# EAGLE schematic schema (EAGLE 7.6.0)
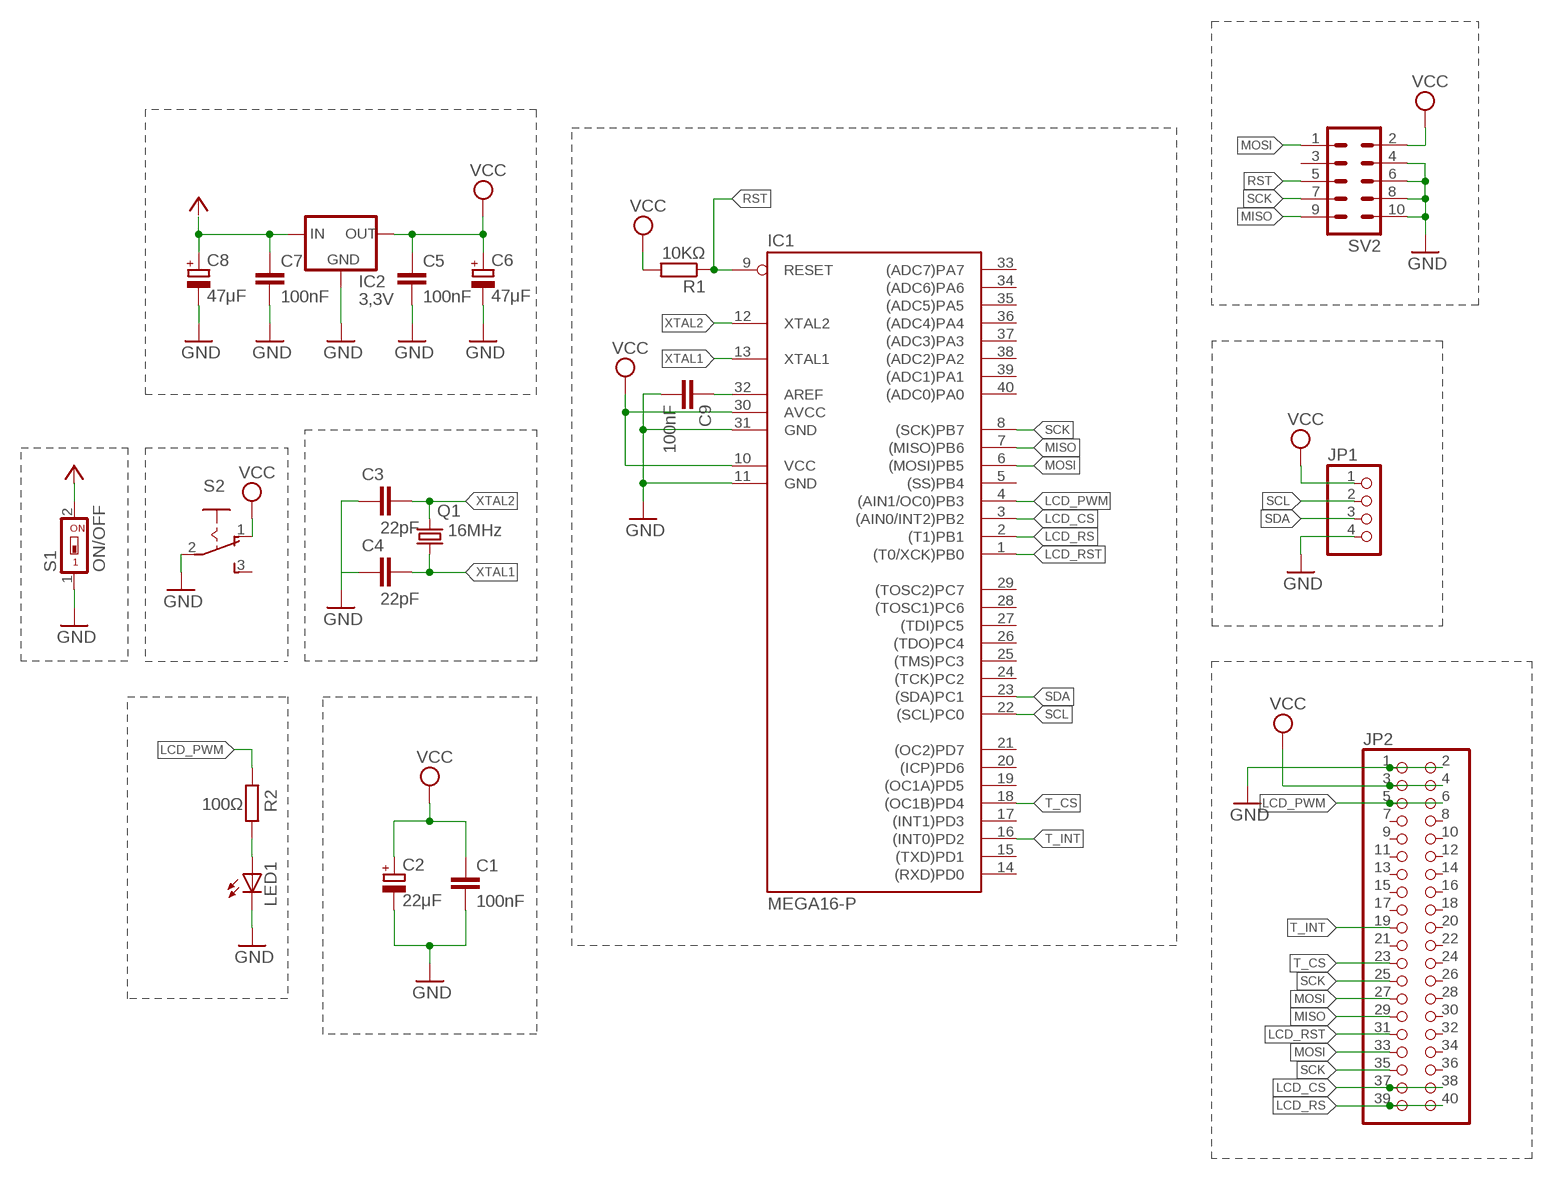
[diagram p0: schematic, sheet 1]

## Parts
C1  100nF  C-EU025-024X044  [C025-024X044]
C2  22μF  CPOL-EU085CS-1AR  [085CS_1AR]
C3  22pF  C-EU025-024X044  [C025-024X044]
C4  22pF  C-EU025-024X044  [C025-024X044]
C5  100nF  C-EU025-024X044  [C025-024X044]
C6  47μF  CPOL-EU085CS-1AR  [085CS_1AR]
C7  100nF  C-EU025-024X044  [C025-024X044]
C8  47μF  CPOL-EU085CS-1AR  [085CS_1AR]
C9  100nF  C-EU025-024X044  [C025-024X044]
IC1  MEGA16-P  [DIL40]
IC2  3,3V  78LXX  [78LXX]
JP1  PINHD-1X4  [1X04]
JP2  PINHD-2X20  [2X20]
LED1  LED  [SMARTLED-TTW]
Q1  16MHz  CRYSTAL68SMX  [86SMX]
R1  10KΩ  R-EU_0204/5  [0204/5]
R2  100Ω  R-EU_0204/5  [0204/5]
S1  ON/OFF  SWS001  [SMS-001]
S2  255SB  [255SB]
SV2  ML10  [ML10]

## Nets
GND: C1.2 C2.- C3.1 C5.2 C6.- C7.2 C8.- C9.2 IC1.11(GND) IC1.31(GND) IC2.GND JP1.4 JP2.1 JP2.2 LED1.C@1(C) S1.1 S2.2(P) SV2.4 SV2.6 SV2.8 SV2.10
LCD_CS: IC1.3((AIN0/INT2)PB2) JP2.37 JP2.38
LCD_PWM: IC1.4((AIN1/OC0)PB3) JP2.5 JP2.6 R2.2
LCD_RS: IC1.2((T1)PB1) JP2.39 JP2.40
LCD_RST: IC1.1((T0/XCK)PB0) JP2.31
MISO: IC1.7((MISO)PB6) JP2.29 SV2.9
MOSI: IC1.6((MOSI)PB5) JP2.27 JP2.33 SV2.1
N$1: LED1.A@1(A) R2.1
N$2: C9.1 IC1.32(AREF)
N$3: S1.2
N$4: C4.1
RST: IC1.9(RESET) R1.1 SV2.5
SCK: IC1.8((SCK)PB7) JP2.25 JP2.35 SV2.7
SCL: IC1.22((SCL)PC0) JP1.2
SDA: IC1.23((SDA)PC1) JP1.3
T_CS: IC1.18((OC1B)PD4) JP2.23
T_INT: IC1.16((INT0)PD2) JP2.19
VCC: C1.1 C2.+ C5.1 C6.+ IC1.10(VCC) IC1.30(AVCC) IC2.OUT JP1.1 JP2.3 JP2.4 R1.2 S2.1(O) SV2.2
VIN: C7.1 C8.+ IC2.IN
XTAL1: C4.2 IC1.13(XTAL1) Q1.4
XTAL2: C3.2 IC1.12(XTAL2) Q1.1
Unconnected: IC1.5((SS)PB4) IC1.14((RXD)PD0) IC1.15((TXD)PD1) IC1.17((INT1)PD3) IC1.19((OC1A)PD5) IC1.20((ICP)PD6) IC1.21((OC2)PD7) IC1.24((TCK)PC2) IC1.25((TMS)PC3) IC1.26((TDO)PC4) IC1.27((TDI)PC5) IC1.28((TOSC1)PC6) IC1.29((TOSC2)PC7) IC1.33((ADC7)PA7) IC1.34((ADC6)PA6) IC1.35((ADC5)PA5) IC1.36((ADC4)PA4) IC1.37((ADC3)PA3) IC1.38((ADC2)PA2) IC1.39((ADC1)PA1) IC1.40((ADC0)PA0) JP2.7 JP2.8 JP2.9 JP2.10 JP2.11 JP2.12 JP2.13 JP2.14 JP2.15 JP2.16 JP2.17 JP2.18 JP2.20 JP2.21 JP2.22 JP2.24 JP2.26 JP2.28 JP2.30 JP2.32 JP2.34 JP2.36 S2.3(S) SV2.3

## Library data of the parts
C1 C3-C5 C7 C9 = rcl:C-EU: CAPACITOR, European symbol
C2 C6 C8 = rcl:CPOL-EU: POLARIZED CAPACITOR, European symbol
IC1 = atmel:MEGA16-P: MICROCONTROLLER 16 Kbytes FLASH 1 kbytes SRAM 512 bytes EEPROM USART 8-channel 10 bit ADC Source: avr.lbr; MPN: ATMEGA16-16PU; OC_FARNELL: 9171142; OC_NEWARK: 01M6885
IC2 = v-reg:78LXX: VOLTAGE REGULATOR
JP1 = pinhead:PINHD-1X4: PIN HEADER
JP2 = pinhead:PINHD-2X20: PIN HEADER
LED1 = led:LED: LED OSRAM: - CHIPLED LG R971, LG N971, LY N971, LG Q971, LY Q971, LO R971, LY R971 LH N974, LH R974 LS Q976, LO Q976, LY Q976 LO Q996 - Hyper CHIPLED LW Q18S LB Q993, LB Q99A, LB R99A - SideLED LS A670, LO A670, LY A670, LG A670, LP A670 LB A673, LV A673, LT A673, LW A673 LH A674 LY A675 LS A676, LA A676, LO A676, LY A676, LW A676 LS A679, LY A679, LG A679 - Hyper Micro SIDELED® LS Y876, LA Y876, LO Y876, LY Y876 LT Y87S - SmartLED LW L88C, LW L88S LB L89C, LB L89S, LG L890 LS L89K, LO L89K, LY L89K LS L896, LA L896, LO L896, LY L896 - TOPLED LS T670, LO T670, LY T670, LG T670, LP T670 LSG T670, LSP T670, LSY T670, LOP T670, LYG T670 LG T671, LOG T671, LSG T671 LB T673, LV T673, LT T673, LW T673 LH T674 LS T676, LA T676, LO T676, LY T676, LB T676, LH T676, LSB T676, LW T676 LB T67C, LV T67C, LT T67C, LS T67K, LO T67K, LY T67K, LW E67C LS E67B, LA E67B, LO E67B, LY E67B, LB E67C, LV E67C, LT E67C LW T67C LS T679, LY T679, LG T679 LS T770, LO T770, LY T770, LG T770, LP T770 LB T773, LV T773, LT T773, LW T773 LH T774 LS E675, LA E675, LY E675, LS T675 LS T776, LA T776, LO T776, LY T776, LB T776 LHGB T686 LT T68C, LB T68C - Hyper Mini TOPLED® LB M676 - Mini TOPLED Santana® LG M470 LS M47K, LO M47K, LY M47K Source: http://www.osram.convergy.de LUXEON: - LUMILED® LXK2-PW12-R00, LXK2-PW12-S00, LXK2-PW14-U00, LXK2-PW14-V00 LXK2-PM12-R00, LXK2-PM12-S00, LXK2-PM14-U00 LXK2-PE12-Q00, LXK2-PE12-R00, LXK2-PE12-S00, LXK2-PE14-T00, LXK2-PE14-U00 LXK2-PB12-K00, LXK2-PB12-L00, LXK2-PB12-M00, LXK2-PB14-N00, LXK2-PB14-P00, LXK2-PB14-Q00 LXK2-PR12-L00, LXK2-PR12-M00, LXK2-PR14-Q00, LXK2-PR14-R00 LXK2-PD12-Q00, LXK2-PD12-R00, LXK2-PD12-S00 LXK2-PH12-R00, LXK2-PH12-S00 LXK2-PL12-P00, LXK2-PL12-Q00, LXK2-PL12-R00 Source: www.luxeon.com KINGBRIGHT: KA-3528ASYC Source: www.kingbright.com
Q1 = crystal:CRYSTAL: CRYSTAL; OC_FARNELL: 6344860; OC_NEWARK: unknown
R1 R2 = rcl:R-EU_: RESISTOR, European symbol
S1 = smd-special:SWS001: SMD Dip Switch 1 pol.
S2 = switch:255SB: SLIDING SWITCH Distributor Buerklin, 11G810
SV2 = con-ml:ML10: HARTING; OC_FARNELL: unknown; OC_NEWARK: unknown